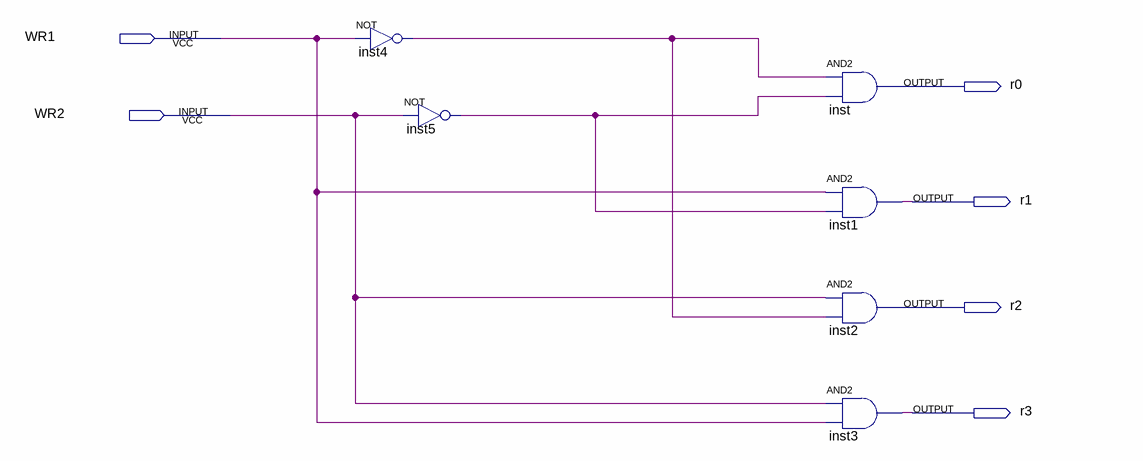
[diagram p0: schematic sheet]
// Quartus schematic 2-4decoder.bdf as structural Verilog: 6 symbols, 6 pins
module \2-4decoder  (
  input  WR1,
  input  WR2,
  output r0,
  output r1,
  output r2,
  output r3
);

  wire inst4_out, inst5_out;

  not inst4 (inst4_out, WR1);
  not inst5 (inst5_out, WR2);
  and inst (r0, inst4_out, inst5_out);
  and inst1 (r1, WR1, inst5_out);
  and inst2 (r2, WR2, inst4_out);
  and inst3 (r3, WR2, WR1);
endmodule
